# Altium schematic sheet Bank0.SchDoc
size A4
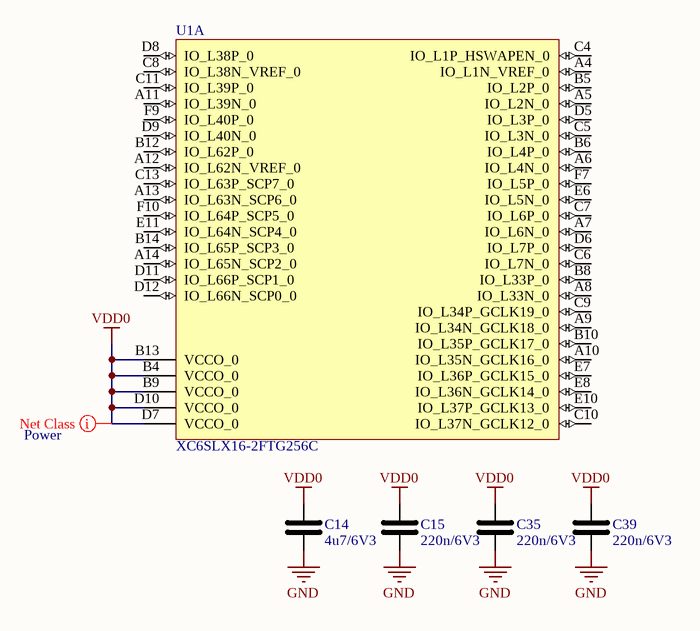
[diagram p0: Bank0.SchDoc]

## Parts
C14  4u7/6V3  [C0805_N]
C15  220n/6V3  [C0402_N]
C35  220n/6V3  [C0402_N]
C39  220n/6V3  [C0402_N]
U1  XC6SLX16-2FTG256C  [Xilinx_FT256_L]  (part A of 5)

## Nets
GND: C14.1 C15.1 C35.1 C39.1
VDD0: C14.2 C15.2 C35.2 C39.2 U1.B4(VCCO_0) U1.B9(VCCO_0) U1.B13(VCCO_0) U1.D7(VCCO_0) U1.D10(VCCO_0)

Not connected (* = marked no-connect by the designer): U1 A4(IO_L1N_VREF_0) A5(IO_L2N_0) A6(IO_L4N_0) A7(IO_L6N_0) A8(IO_L33N_0) A9(IO_L34N_GCLK18_0) A10(IO_L35N_GCLK16_0) A11(IO_L39N_0) A12(IO_L62N_VREF_0) A13(IO_L63N_SCP6_0) A14(IO_L65N_SCP2_0) B5(IO_L2P_0) B6(IO_L4P_0) B8(IO_L33P_0) B10(IO_L35P_GCLK17_0) B12(IO_L62P_0) B14(IO_L65P_SCP3_0) C4(IO_L1P_HSWAPEN_0) C5(IO_L3N_0) C6(IO_L7N_0) C7(IO_L6P_0) C8(IO_L38N_VREF_0) C9(IO_L34P_GCLK19_0) C10(IO_L37N_GCLK12_0) C11(IO_L39P_0) C13(IO_L63P_SCP7_0) D5(IO_L3P_0) D6(IO_L7P_0) D8(IO_L38P_0) D9(IO_L40N_0) D11(IO_L66P_SCP1_0) D12(IO_L66N_SCP0_0) E6(IO_L5N_0) E7(IO_L36P_GCLK15_0) E8(IO_L36N_GCLK14_0) E10(IO_L37P_GCLK13_0) E11(IO_L64N_SCP4_0) F7(IO_L5P_0) F9(IO_L40P_0) F10(IO_L64P_SCP5_0)

## Layout directives
net class Power: VDD0

## Library data of the parts
C14 C15 C35 C39 = C